# EAGLE design imu-shield (EAGLE 8.6.1)
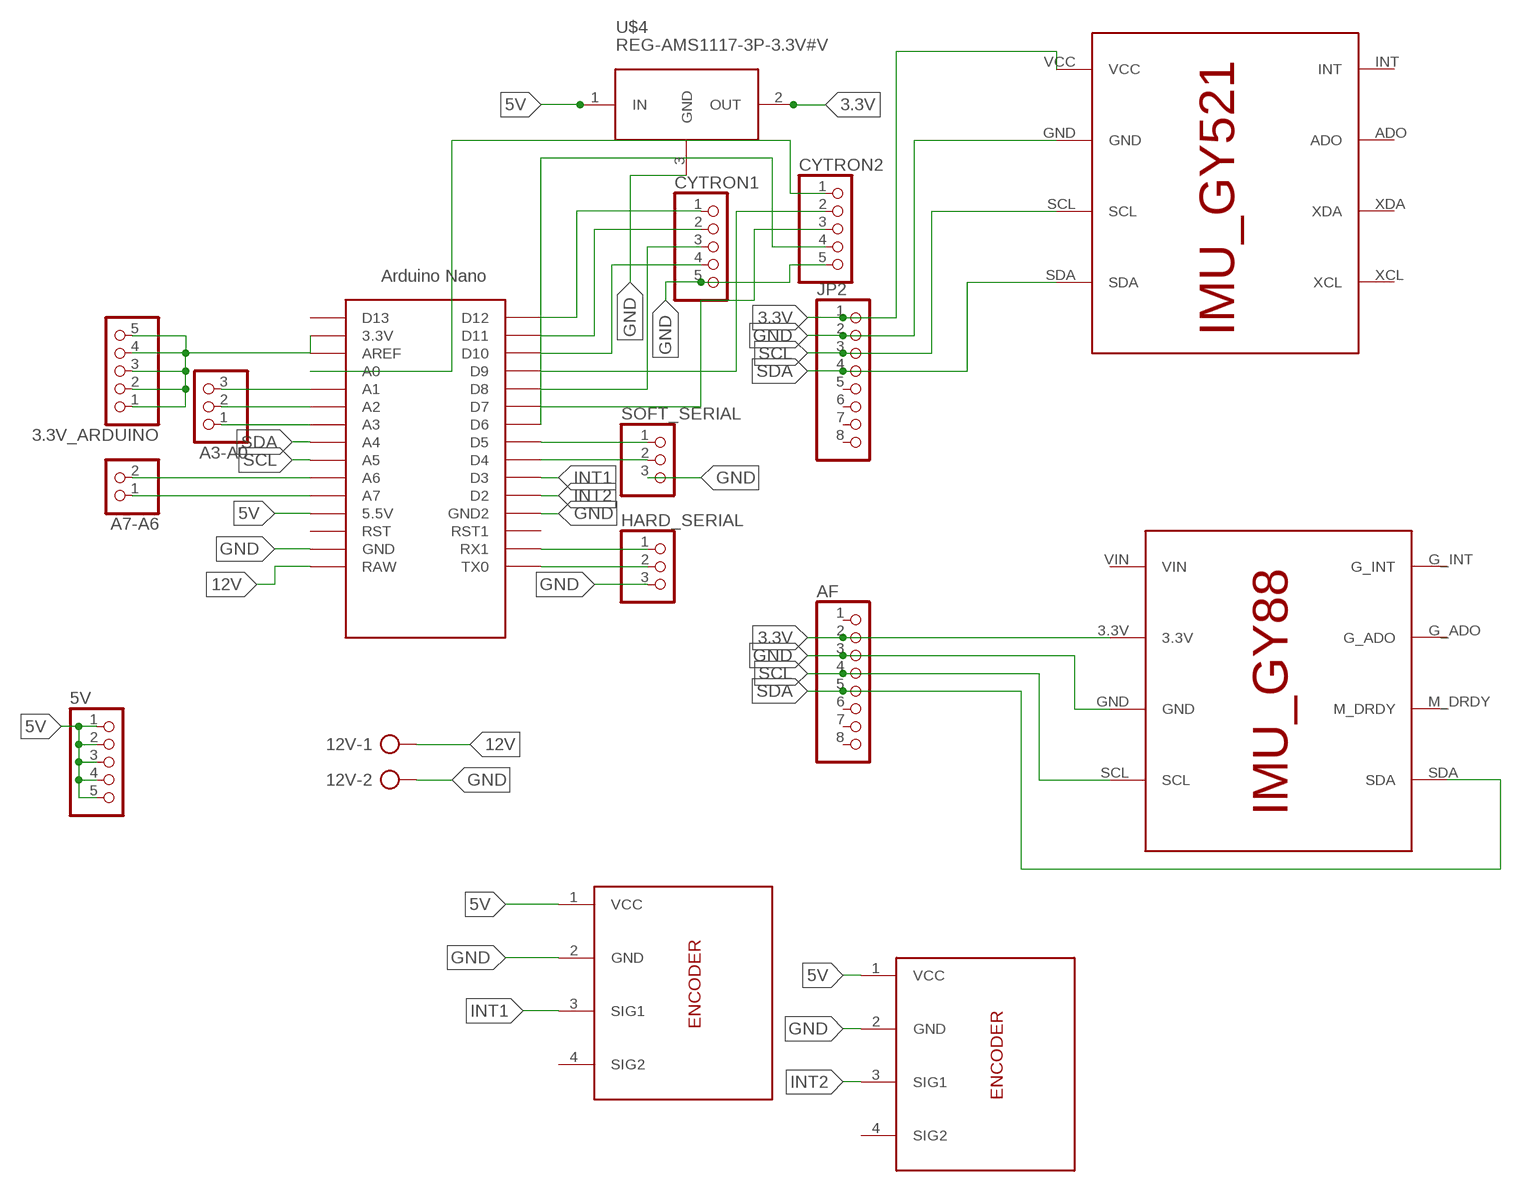
[diagram p0: schematic, sheet 1]

## Parts
3.3V_ARDUINO  PINHD-1X5  [1X05]
5V  PINHD-1X5  [1X05]
12V  AK300/2  [AK300/2]
A3-A0  PINHD-1X3  [1X03]
A7-A6  PINHD-1X2  [1X02]
AF  PINHD-1X8  [1X08]
CYTRON1  PINHD-1X5  [1X05]
CYTRON2  PINHD-1X5  [1X05]
ENCODER1  ENCODER  [1X04]
ENCODER2  ENCODER  [1X04]
HARD_SERIAL  PINHD-1X3  [1X03]
JP2  PINHD-1X8  [1X08]
SOFT_SERIAL  PINHD-1X3  [1X03]
U$1  NANO  [NANO]
U$2  IMU_ROBOCON  [IMU_GY521]
U$3  IMU_MINESWEEPER  [IMU_GY88]
U$4  REG-AMS1117-3P-3.3V#V  [REG-AMS1117-3P#V]

## Nets
3.3V: AF.2 JP2.1 U$2.VCC U$3.3.3V U$4.2(OUT)
5V: 5V.1 5V.2 5V.3 5V.4 5V.5 ENCODER1.1(VCC) ENCODER2.1(VCC) U$1.5V(5.5V) U$4.1(IN)
12V: 12V.1 U$1.RAW
GND: 12V.2 AF.3 CYTRON1.5 CYTRON2.5 ENCODER1.2(GND) ENCODER2.2(GND) HARD_SERIAL.3 JP2.2 SOFT_SERIAL.3 U$1.GND U$1.GND1(GND2) U$2.GND U$3.GND U$4.3(GND)
INT1: ENCODER2.3(SIG1) U$1.D3
INT2: ENCODER1.3(SIG1) U$1.D2
N$1: SOFT_SERIAL.1 U$1.D5
N$2: SOFT_SERIAL.2 U$1.D4
N$3: HARD_SERIAL.1 U$1.RX1
N$4: HARD_SERIAL.2 U$1.TX0
N$5: CYTRON1.1 U$1.D12
N$6: CYTRON1.2 U$1.D11
N$7: CYTRON1.4 U$1.D10
N$8: CYTRON2.2 U$1.D9
N$9: CYTRON1.3 U$1.D8
N$10: CYTRON2.3 U$1.D7
N$11: CYTRON2.4 U$1.D6
N$12: CYTRON2.1 U$1.A0
N$18: A3-A0.1 U$1.A3
N$19: A3-A0.2 U$1.A2
N$20: A3-A0.3 U$1.A1
N$22: A7-A6.1 U$1.A7
N$23: A7-A6.2 U$1.A6
N$26: 3.3V_ARDUINO.1 3.3V_ARDUINO.2 3.3V_ARDUINO.3 3.3V_ARDUINO.4 3.3V_ARDUINO.5 U$1.3.3V
SCL: AF.4 JP2.3 U$1.A5 U$2.SCL U$3.SCL
SDA: AF.5 JP2.4 U$1.A4 U$2.SDA U$3.SDA
Unconnected: AF.1 AF.6 AF.7 AF.8 ENCODER1.4(SIG2) ENCODER2.4(SIG2) JP2.5 JP2.6 JP2.7 JP2.8 U$1.AREF U$1.D13 U$1.RST U$1.RST1 U$2.ADO U$2.INT U$2.XCL U$2.XDA U$3.G_ADO U$3.G_INT U$3.M_DRDY U$3.VIN

## Library data of the parts
3.3V_ARDUINO CYTRON1 CYTRON2 = pinhead:PINHD-1X5: PIN HEADER
5V = MIA_LIBRARY:PINHD-1X5: PIN HEADER
12V = con-ptr500:AK300/2: CONNECTOR; OC_FARNELL: unknown; OC_NEWARK: unknown
A3-A0 HARD_SERIAL SOFT_SERIAL = pinhead:PINHD-1X3: PIN HEADER
A7-A6 = pinhead:PINHD-1X2: PIN HEADER
AF JP2 = pinhead:PINHD-1X8: PIN HEADER
ENCODER1 ENCODER2 = MIA_LIBRARY:ENCODER
U$1 = Arduino-clone:NANO: Arduino Nano
U$2 = MIA_LIBRARY:IMU_ROBOCON
U$3 = MIA_LIBRARY:IMU_MINESWEEPER
U$4 = MIA_LIBRARY:REG-AMS1117-3P-*: Linear Regulator based on AMS1117 chip 3-pin version AMS1117 datasheet is available here: http://www.advanced-monolithic.com/pdf/ds1117.pdf Click here to find device on ebay.com <http://www.ebay.com/sch/ams1117+module> Note: There are many variants. Search for the proper version.

## Board
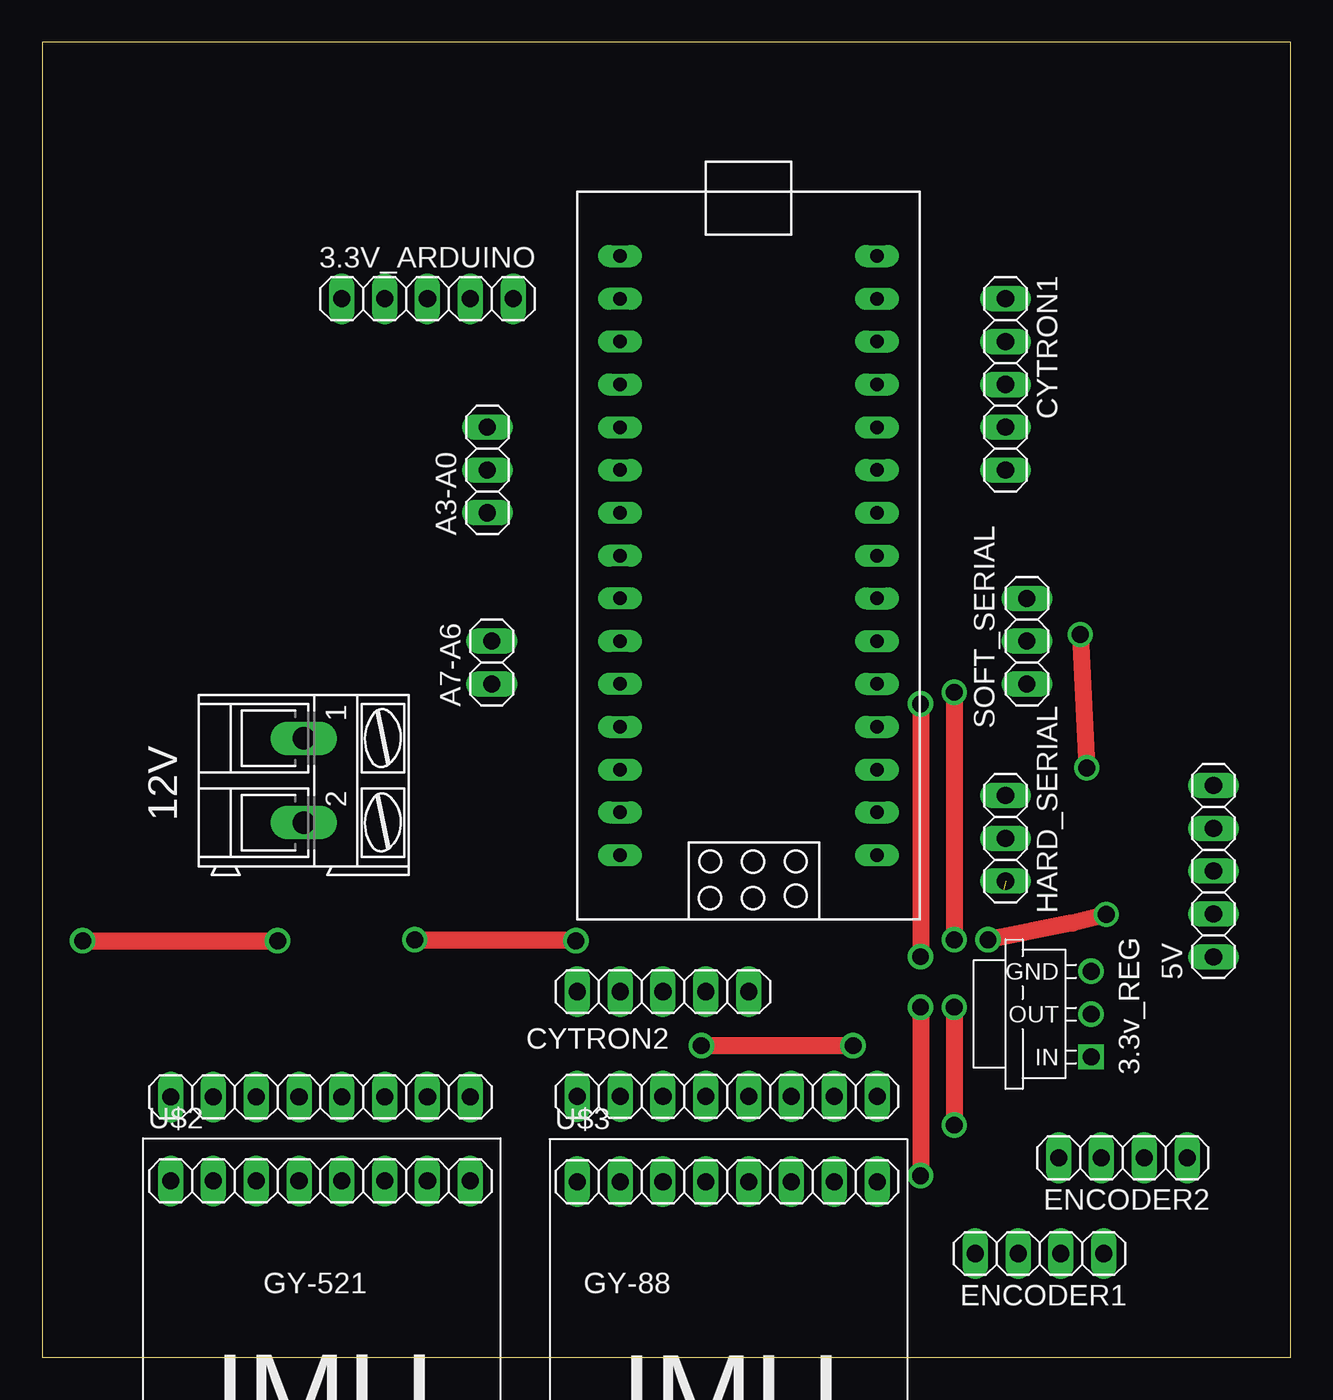
[diagram p1: board, top side]
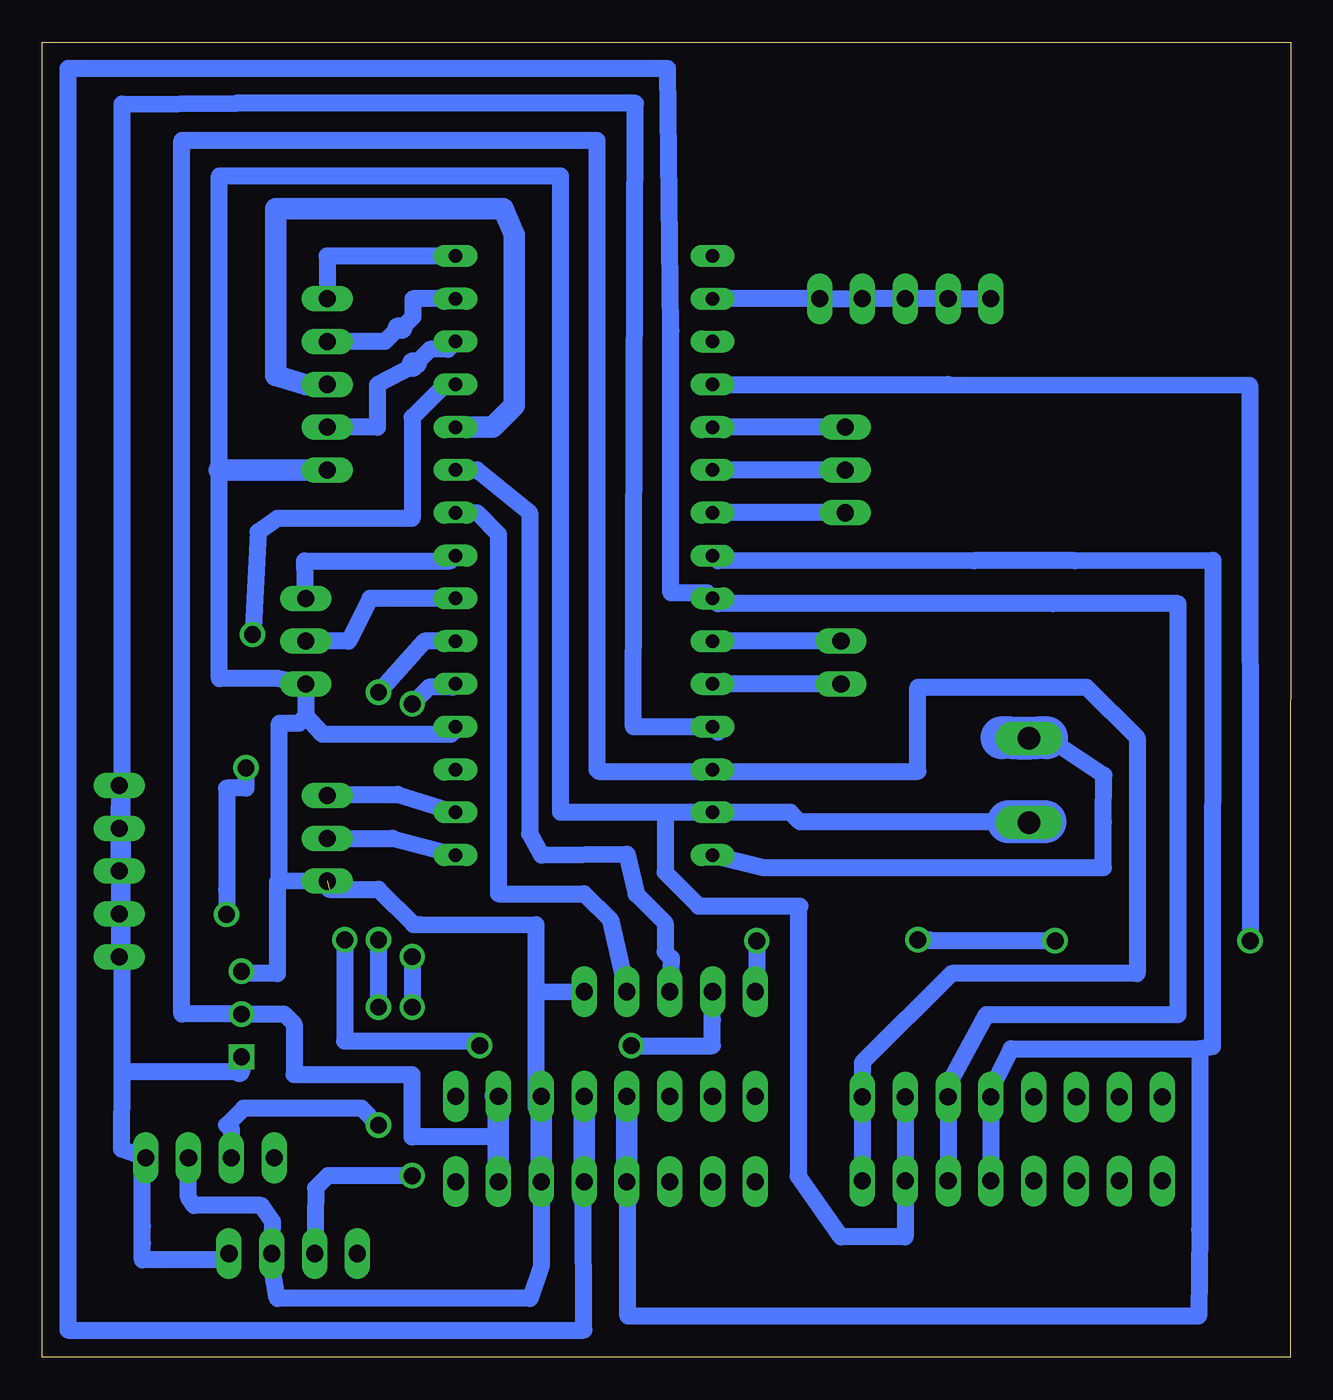
[diagram p2: board, bottom side, seen from below]

Size 74.06 x 78.05 mm. Coordinates in mm from the lower left corner, seen from the top.
Outline: 0.01,0 74.06,0 74.06,78.05 0,78.05 0.01,0
Copper layers (1*16): Top 0.035mm / dielectric 1.5mm / Bottom 0.035mm
Design rules "default *": minimum track width 1mm, minimum drill 1mm, track to track 0.8mm, track to pad 0.8mm, pad to pad 6mil, via to via 6mil, smd to smd 6mil, copper to edge 0.8mm, drill to drill 6mil, minimum pad ring 10mil, minimum via ring 8mil, stop-mask expansion 4mil, vias tented up to drill 0mil, thermal gap 10mil

### Footprints (pad centres in the part's own frame; a part is rotated, then mirrored left to right if it is on the bottom)
1X05 = drill 1.016 long: 1 -5.08,0; 2 -2.54,0; 3 0,0; 4 2.54,0; 5 5.08,0
AK300/2 = drill 1.321 long: 1 -2.515,0; 2 2.489,0
1X03 = drill 1.016 long: 1 -2.54,0; 2 0,0; 3 2.54,0
1X02 = drill 1.016 long: 1 -1.27,0; 2 1.27,0
1X08 = drill 1.016 long: 1 -8.89,0; 2 -6.35,0; 3 -3.81,0; 4 -1.27,0; 5 1.27,0; 6 3.81,0; 7 6.35,0; 8 8.89,0
1X04 = drill 1.016 long: 1 -3.81,0; 2 -1.27,0; 3 1.27,0; 4 3.81,0
NANO = drill 0.8 long: 3.3V -10.16,24.13; 5V -10.16,-1.27; A0 -10.16,19.05; A1 -10.16,16.51; A2 -10.16,13.97; A3 -10.16,11.43; A4 -10.16,8.89; A5 -10.16,6.35; A6 -10.16,3.81; A7 -10.16,1.27; AREF -10.16,21.59; D2 5.08,1.27; D3 5.08,3.81; D4 5.08,6.35; D5 5.08,8.89; D6 5.08,11.43; D7 5.08,13.97; D8 5.08,16.51; D9 5.08,19.05; D10 5.08,21.59; D11 5.08,24.13; D12 5.08,26.67; D13 -10.16,26.67; GND -10.16,-6.35; GND1 5.08,-1.27; RAW -10.16,-8.89; RST -10.16,-3.81; RST1 5.08,-3.81; RX1 5.08,-6.35; TX0 5.08,-8.89
IMU_GY521 = drill 1.016 long: ADO -6.35,0; GND 6.35,0; INT -8.89,0; SCL 3.81,0; SDA 1.27,0; VCC 8.89,0; XCL -3.81,0; XDA -1.27,0
IMU_GY88 = drill 1.016 long: 3.3V 6.35,0; G_ADO -6.35,0; G_INT -8.89,0; GND 3.81,0; M_DRDY -3.81,0; SCL 1.27,0; SDA -1.27,0; VIN 8.89,0
REG-AMS1117-3P#V = drill 1 square: 1 -2.54,-5.08 | drill 1: 2 0,-5.08; 3 2.54,-5.08

### Placement (x,y rotation side)
3.3V_ARDUINO  22.86,62.82 0 top
5V  69.49,28.86 90 top
12V  15.52,34.22 270 top
A3-A0  26.42,52.66 90 top
A7-A6  26.67,41.23 90 top
AF  40.64,15.49 180 top
CYTRON1  57.15,57.74 270 top
CYTRON2  36.83,21.7 0 top
ENCODER1  59.17,6.16 180 top
ENCODER2  64.11,11.84 180 top
HARD_SERIAL  57.15,30.8 270 top
JP2  16.51,15.45 180 top
SOFT_SERIAL  58.42,42.5 270 top
U$1  44.45,38.69 0 top
U$2  16.51,10.47 0 top
U$3  40.64,10.43 0 top
U$4  57.15,20.37 90 top

### Tracks (layer width: path | path; a pad name or v marks a point on that pad's centre or on a via)
3.3V
  Bottom 1: U$2.VCC JP2.1 25.4,17.49 20.11,22.78 9.11,22.78 9.11,36.78 12.11,39.78 22.11,39.78 22.11,34.78 41.05,34.78 41.15,34.88 41.15,72.22 65.77,72.22 65.77,20.37 U$4.2 59.7,20.37 59.11,19.78 59.11,16.78 52.11,16.78 52.11,13.08 46.99,13.08
  Bottom 1.27: 47.18,15.51 AF.2 46.99,13.08 U$3.3.3V
5V
  Bottom 1: 33.97,37.1 U$1.5V 36.07,37.42 38.99,37.41 38.86,74.41 62.58,74.41 69.31,74.38 69.31,32.78 | 69.31,16.96 62.36,16.96 | 69.31,16.96 69.34,12.35 ENCODER2.1 68.11,11.59 68.11,7.78 68.11,6.78 68.11,5.78 63.35,5.78 ENCODER1.1 | 69.31,16.96 69.31,28.68 | 69.31,31.22 69.31,32.78 | 5V.3 69.49,32.6 | 69.49,32.6 69.31,32.78 | 5V.5 69.49,32.6 | 5V.4 69.31,31.22 | 69.31,31.22 69.31,28.68 | 5V.3 69.31,28.68 | 5V.1 5V.2 5V.3
  Bottom 1.27: 62.36,16.96 U$4.1
12V
  Bottom 1: U$1.RAW 31.27,29.06 11.11,29.06 11.11,31.78 11.08,34.54 14.47,36.78
  Bottom 2.54: 14.47,36.78 12V.1 16.06,36.74 17.11,36.78
GND  (1 unrouted)
  Bottom 1: U$1.GND1 49.8,36.97 57.42,36.97 58.42,38.06 | 58.42,38.06 SOFT_SERIAL.3 60.01,40.28 63.55,40.28 63.55,52.66 63.55,70.12 43.3,70.12 43.3,32.34 | 57.04,27.78 54.11,27.78 52.02,25.69 51.64,25.69 44.77,25.67 44.77,21.65 44.77,14.88 AF.3 | 58.42,38.06 58.83,37.65 59.98,37.65 60.01,33.29 60.01,28.3 | 60.01,28.3 HARD_SERIAL.3 | JP2.2 U$2.GND 22.86,7.15 26.67,7.15 29.21,10.75 29.21,26.68 29.11,26.78 35.11,26.78 37.11,28.78 37.11,32.34 | U$3.GND 44.45,5.44 45.11,3.5 60.11,3.5 60.38,5.05 ENCODER1.2 60.38,8.05 61.05,9.01 65.05,9.01 65.38,9.5 ENCODER2.2 | 60.01,28.3 60.11,28.2 60.11,22.78 62.1,22.78 U$4.3 | 12V.2 14.57,31.78 | 16.73,31.78 29.11,31.78 29.67,32.34 U$1.GND
  Bottom 1.016: U$1.GND 37.11,32.34 43.3,32.34 | CYTRON2.5 44.77,21.65
  Bottom 1.27: AF.3 U$3.GND | CYTRON1.5 63.55,52.66
  Bottom 2.54: 14.57,31.78 16.73,31.78
INT1  (via drill 1)
  Top 1: v54.11,39.47 v54.11,24.78 | v54.11,20.78 v54.11,13.78
  Bottom 1: U$1.D3 51.39,42.5 v54.11,39.47 | v54.11,24.78 v54.11,20.78 | v54.11,13.78 55.11,14.78 62.11,14.78 63.11,13.78 62.84,13.51 ENCODER2.3
INT2  (via drill 1)
  Top 1: v52.11,20.78 v52.11,10.78 | v52.11,38.78 v52.11,23.78
  Bottom 1: U$1.D2 49.71,39.78 51.11,39.78 v52.11,38.78 | v52.11,23.78 v52.11,20.78 | v52.11,10.78 57.11,10.78 57.84,10.05 ENCODER1.3
N$1
  Bottom 1: U$1.D5 49.85,47.26 58.48,47.26 SOFT_SERIAL.1
N$2
  Bottom 1: 49.47,44.98 U$1.D4 54.61,45.04 55.88,42.5 SOFT_SERIAL.2 57.34,42.56
N$3
  Bottom 1: HARD_SERIAL.1 57.07,33.42 52.97,33.42 U$1.RX1
N$4
  Bottom 1: HARD_SERIAL.2 53.26,30.8 U$1.TX0
N$5
  Bottom 1: U$1.D12 57.15,65.36 CYTRON1.1
N$6
  Bottom 1: U$1.D11 52.07,62.82 52.07,61.74 52.73,61.08 | 52.93,61.08 53.73,60.28 CYTRON1.2
  Bottom 1.27: 52.73,61.08 52.93,61.08
N$7
  Bottom 1: U$1.D10 49.98,59.83 51.05,59.83 51.87,59.01 | 52.07,58.81 54.18,57.72 54.18,55.2 CYTRON1.4
  Bottom 1.27: 51.87,59.01 52.07,59.01 52.07,58.81
N$8  (via drill 1)
  Top 1: v63.12,26.29 61.11,25.78 v56.11,24.78 | v48.11,18.5 v39.11,18.5
  Top 1.016: v61.58,42.9 v61.97,34.99
  Bottom 1: 50.15,57.74 52.11,55.78 52.11,49.78 60.11,49.78 | 61.25,48.98 61.54,43.29 | 63.11,27.78 v63.12,26.29 | v56.11,24.78 56.11,18.78 48.11,18.78 v48.11,18.5 | v39.11,18.5 34.3,18.49 34.3,20 CYTRON2.2
  Bottom 1.016: U$1.D9 50.15,57.74 | 60.11,49.78 61.25,48.98 | 61.62,42.75 61.54,43.29 v61.58,42.9 | v61.97,34.99 61.97,34.78 61.98,33.78 63.11,33.78 63.11,27.78
N$9
  Bottom 1.27: U$1.D8 47.34,55.2 46.07,56.47 46.07,66.63 46.7,68.16 60.2,68.16 60.2,58.25 58.42,57.74 CYTRON1.3
N$10
  Bottom 1.016: U$1.D7 48.26,52.66 45.14,50.12 45.14,31.07 44.45,29.8 39.37,29.87 38.83,27.5 37.11,25.78 37.11,24.06 36.73,23.68 CYTRON2.3
N$11
  Bottom 1: 40.37,25.99 CYTRON2.4
  Bottom 1.016: U$1.D6 48.26,50.12 46.99,48.85 46.99,27.52 41.91,27.52 40.37,25.99
N$12  (via drill 1)
  Top 1.016: v2.4,24.72 v13.97,24.72 | v22.11,24.78 31.61,24.78 v31.66,24.72
  Bottom 1.016: U$1.A0 20.32,57.74 2.42,57.68 v2.4,24.72 | v13.97,24.72 21.4,24.72 21.46,24.78 v22.11,24.78 | v31.66,24.72 31.66,21.97 CYTRON2.1
N$18
  Bottom 1: A3-A0.1 U$1.A3
N$19
  Bottom 1: A3-A0.2 U$1.A2
N$20
  Bottom 1: A3-A0.3 U$1.A1
N$22
  Bottom 1: A7-A6.1 U$1.A7
N$23
  Bottom 1: A7-A6.2 U$1.A6
N$26
  Bottom 1: 3.3V_ARDUINO.1 3.3V_ARDUINO.2 3.3V_ARDUINO.3 3.3V_ARDUINO.4 3.3V_ARDUINO.5 U$1.3.3V
SCL
  Bottom 1: 41.97,10.43 41.97,9.48 41.92,1.61 72.53,1.61 72.53,76.47 72.11,76.47 36.96,76.47 36.77,60.92 36.77,45.36 34.61,45.36 U$1.A5 33.97,44.72 14.1,44.72 6.67,44.72 6.67,20.34 18.03,20.34 20.32,16.15 JP2.3 U$2.SCL
  Bottom 1.27: AF.4 U$3.SCL 41.97,10.69 41.97,9.48
SDA
  Bottom 1: U$1.A4 33.97,47.26 18.75,47.28 12.8,47.28 12.78,47.26 4.6,47.29 4.62,18.44 5.4,18.31 | 5.4,18.31 16.57,18.31 17.78,15.83 JP2.4 U$2.SDA | 39.31,10.43 39.31,9.48 39.31,2.45 5.46,2.45 5.4,7.58 5.4,18.31
  Bottom 1.27: AF.5 U$3.SDA 39.31,10.69 39.31,9.48

### Text on the board
tPlace: 3.3v_REG | GY-521 | GY-88